# Altium schematic sheet Power_USB.SchDoc
size A4; Organization: C.E.S.A.R; Address1: Rua Bione, 220; Address2: Bairro do Recife; Address3: Recife - PE - Brasil; Address4: 50030-390
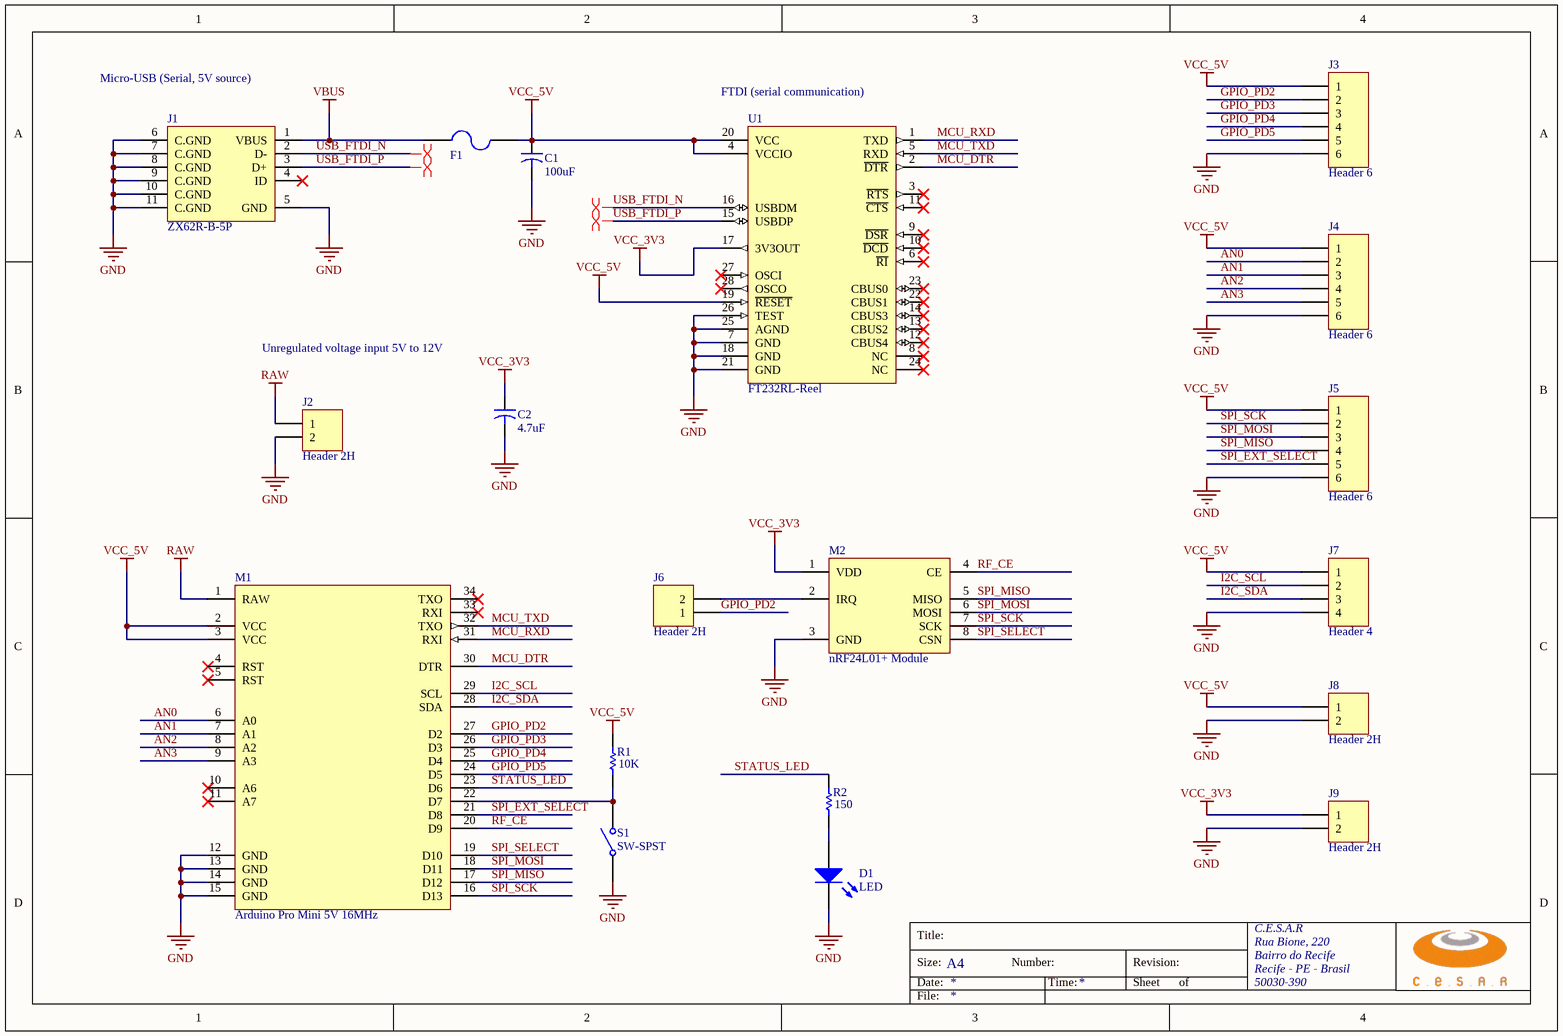
[diagram p0: Power_USB.SchDoc]

## Parts
C1  value 100uF  [CAP Radial 100uF]  (hidden comment: CAPC1608L)
C2  value 4.7uF  [CAP RADIAL MINIATURE]  (hidden comment: CAPC1608L)
D1  LED  [LED]
F1  0402L050SLKR  [0805L]  (value not drawn)
J1  ZX62R-B-5P  [Micro USB b]
J2  Header 2H  [HDR1X2]
J3  Header 6  [HDR1X6]
J4  Header 6  [HDR1X6]
J5  Header 6  [HDR1X6]
J6  Header 2H  [HDR1X2]
J7  Header 4  [HDR1X4]
J8  Header 2H  [HDR1X2]
J9  Header 2H  [HDR1X2]
M1  Arduino Pro Mini 5V 16MHz  [Arduino Pro Mini]
M2  nRF24L01+ Module  [nRF24L01+ Module]
R1  value 10K  [AXIAL-3mm]  (hidden comment: Res1)
R2  value 150  [AXIAL-3mm]  (hidden comment: Res1)
S1  SW-SPST  [SWITCH TS-1181]
U1  FT232RL-Reel  [SSOP-28_N]

## Nets
GND: C1.2 C2.2 D1.2(K) J1.5(GND) J1.6(C.GND) J1.7(C.GND) J1.8(C.GND) J1.9(C.GND) J1.10(C.GND) J1.11(C.GND) J2.2 J3.6 J4.6 J5.6 J7.4 J8.2 J9.2 M1.12(GND) M1.13(GND) M1.14(GND) M1.15(GND) M2.3(GND) S1.1(COMMON) U1.7(GND) U1.18(GND) U1.21(GND) U1.25(AGND) U1.26(TEST)
RAW: J2.1 M1.1(RAW)
VBUS: F1.1 J1.1(VBUS)
VCC_3V3: C2.1 J9.1 M2.1(VDD) U1.17(3V3OUT)
VCC_5V: C1.1 F1.2 J3.1 J4.1 J5.1 J7.1 J8.1 M1.2(VCC) M1.3(VCC) R1.1 U1.4(VCCIO) U1.19(~{RESET}) U1.20(VCC)
AN0: J4.2 M1.6(A0)
AN1: J4.3 M1.7(A1)
AN2: J4.4 M1.8(A2)
AN3: J4.5 M1.9(A3)
GPIO_PD2: J3.2 J6.1 M1.27(D2)
GPIO_PD3: J3.3 M1.26(D3)
GPIO_PD4: J3.4 M1.25(D4)
GPIO_PD5: J3.5 M1.24(D5)
I2C_SCL: J7.2 M1.29(SCL)
I2C_SDA: J7.3 M1.28(SDA)
MCU_DTR: M1.30(DTR) U1.2(~{DTR})
MCU_RXD: M1.31(RXI) U1.1(TXD)
MCU_TXD: M1.32(TXO) U1.5(RXD)
RF_CE: M1.20(D9) M2.4(CE)
SPI_EXT_SELECT: J5.5 M1.21(D8)
SPI_MISO: J5.4 M1.17(D12) M2.5(MISO)
SPI_MOSI: J5.3 M1.18(D11) M2.6(MOSI)
SPI_SCK: J5.2 M1.16(D13) M2.7(SCK)
SPI_SELECT: M1.19(D10) M2.8(CSN)
STATUS_LED: M1.23(D6) R2.1
USB_FTDI_N: J1.2(D-) U1.16(USBDM)
USB_FTDI_P: J1.3(D+) U1.15(USBDP)
NetD1_1: D1.1(A) R2.2
NetJ6_2: J6.2 M2.2(IRQ)
NetM1_22: M1.22(D7) R1.2 S1.2(NO)

Not connected (* = marked no-connect by the designer): J1 4(ID)*; M1 4(RST)* 5(RST)* 10(A6)* 11(A7)* 33(RXI)* 34(TXO)*; U1 3(~{RTS})* 6(~{RI})* 8(NC)* 9(~{DSR})* 10(~{DCD})* 11(~{CTS})* 12(CBUS4)* 13(CBUS2)* 14(CBUS3)* 22(CBUS1)* 23(CBUS0)* 24(NC)* 27(OSCI)* 28(OSCO)*

## Layout directives
differential pair: USB_FTDI_N, USB_FTDI_P

## Notes on the sheet
- Micro-USB (Serial, 5V source)
- (near U1) FTDI (serial communication)
- Unregulated voltage input 5V to 12V
- Title:
- Size:
- Date:
- A4
- Number:
- Time:
- Revision:
- Sheet
- of
- File:

## Library data of the parts
C1 C2 = CAPC1608L: 4.7µF 10V Ceramic Capacitor X5R 0603; Published: 23-Sep-2002; PackageReference: CC0603KRX5R6BB475; Publisher: Altium Limited; PackageDescription: Capacitor; 2 Leads
D1 = LED: Typical RED, GREEN, YELLOW, AMBER GaAs LED; Published: 8-Jun-2000; LatestRevisionDate: 17-Jul-2002; LatestRevisionNote: Re-released for DXP Platform.; PackageVersion: Feb-2002; PackageReference: 3.2X1.6X1.1; Publisher: Altium Limited; PackageDescription: SM LED; 2 Flat Leads
F1 = Fuse 2: PTC Resettable Fuse 6V 500mA Ih Surface Mount 0402 (1005 Metric), Concave; PartNumb: F5759DKR-ND
J1 = ZX62R-B-5P: USB Connector; Supplier 1: Digi-Key; Supplier Part Number 1: H11574TR-ND
J2 J6 J8 J9 = Header 2H: Header, 2-Pin, Right Angle; LatestRevisionDate: 17-Jul-2002; LatestRevisionNote: Re-released for DXP Platform.; Publisher: Altium Limited
J3-J5 = Header 6: Header, 6-Pin; LatestRevisionDate: 17-Jul-2002; LatestRevisionNote: Re-released for DXP Platform.; Publisher: Altium Limited
J7 = Header 4: Header, 4-Pin; LatestRevisionDate: 17-Jul-2002; LatestRevisionNote: Re-released for DXP Platform.; Publisher: Altium Limited
R1 R2 = Res1: Resistor; Published: 8-Jun-2000; LatestRevisionDate: 17-Jul-2002; LatestRevisionNote: Re-released for DXP Platform.; PackageReference: AXIAL-0.3; Publisher: Altium Limited; PackageDescription: Axial Device, Thru-Hole; 2 Leads; 0.3 in Pin Spacing
S1 = SW-SPST: Single-Pole, Single-Throw Switch; Published: 24-Mar-1999; LatestRevisionDate: 17-Jul-2002; LatestRevisionNote: Re-released for DXP Platform.; PackageReference: SPST-2; Publisher: Altium Limited; PackageDescription: Switch; 2 Leads
U1 = FT232RL-Reel: USB UART Asynchronous Serial Data Transfer Chip, 28-pin SSOP, Tape and Reel; Manufacturer: FTDI; DatasheetVersion: ver 2.10, Mar-2012; PackageVersion: Mar-12; PackageReference: SSOP-28; PackageDescription: 28-Pin Small Outline Package 0.65 mm Pitch; PartNumber: FT232RL-Reel; ComponentLink1Description: Manufacturer URL; ComponentLink1URL: http://www.ftdichip.com/; ComponentLink2Description: Datasheet; ComponentLink2URL: http://www.ftdichip.com/Support/Documents/DataSheets/ICs/DS_FT232R.pdf; Supplier 1: Digi-Key; Supplier Part Number 1: 768-1007-6-ND